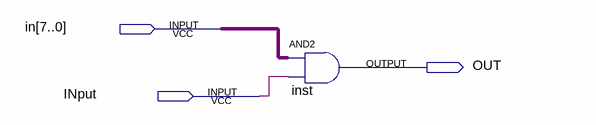
[diagram p0: schematic sheet]
// Quartus schematic test.bdf as structural Verilog: 1 symbols, 3 pins
module test (
  input  [7:0] in,
  input  INput,
  output OUT
);

  assign OUT = in & {8{INput}};  // AND2 inst, 8 bits wide
endmodule
